# EasyEDA schematic 1-Schematic_TT2.json

## Sheets
1 Sheet_1: TITLE: Sheet_1; REV: 1.0; Date: 2024-10-06; Sheet: 1/1; Drawn By: benjaort2001; Company: Your Company
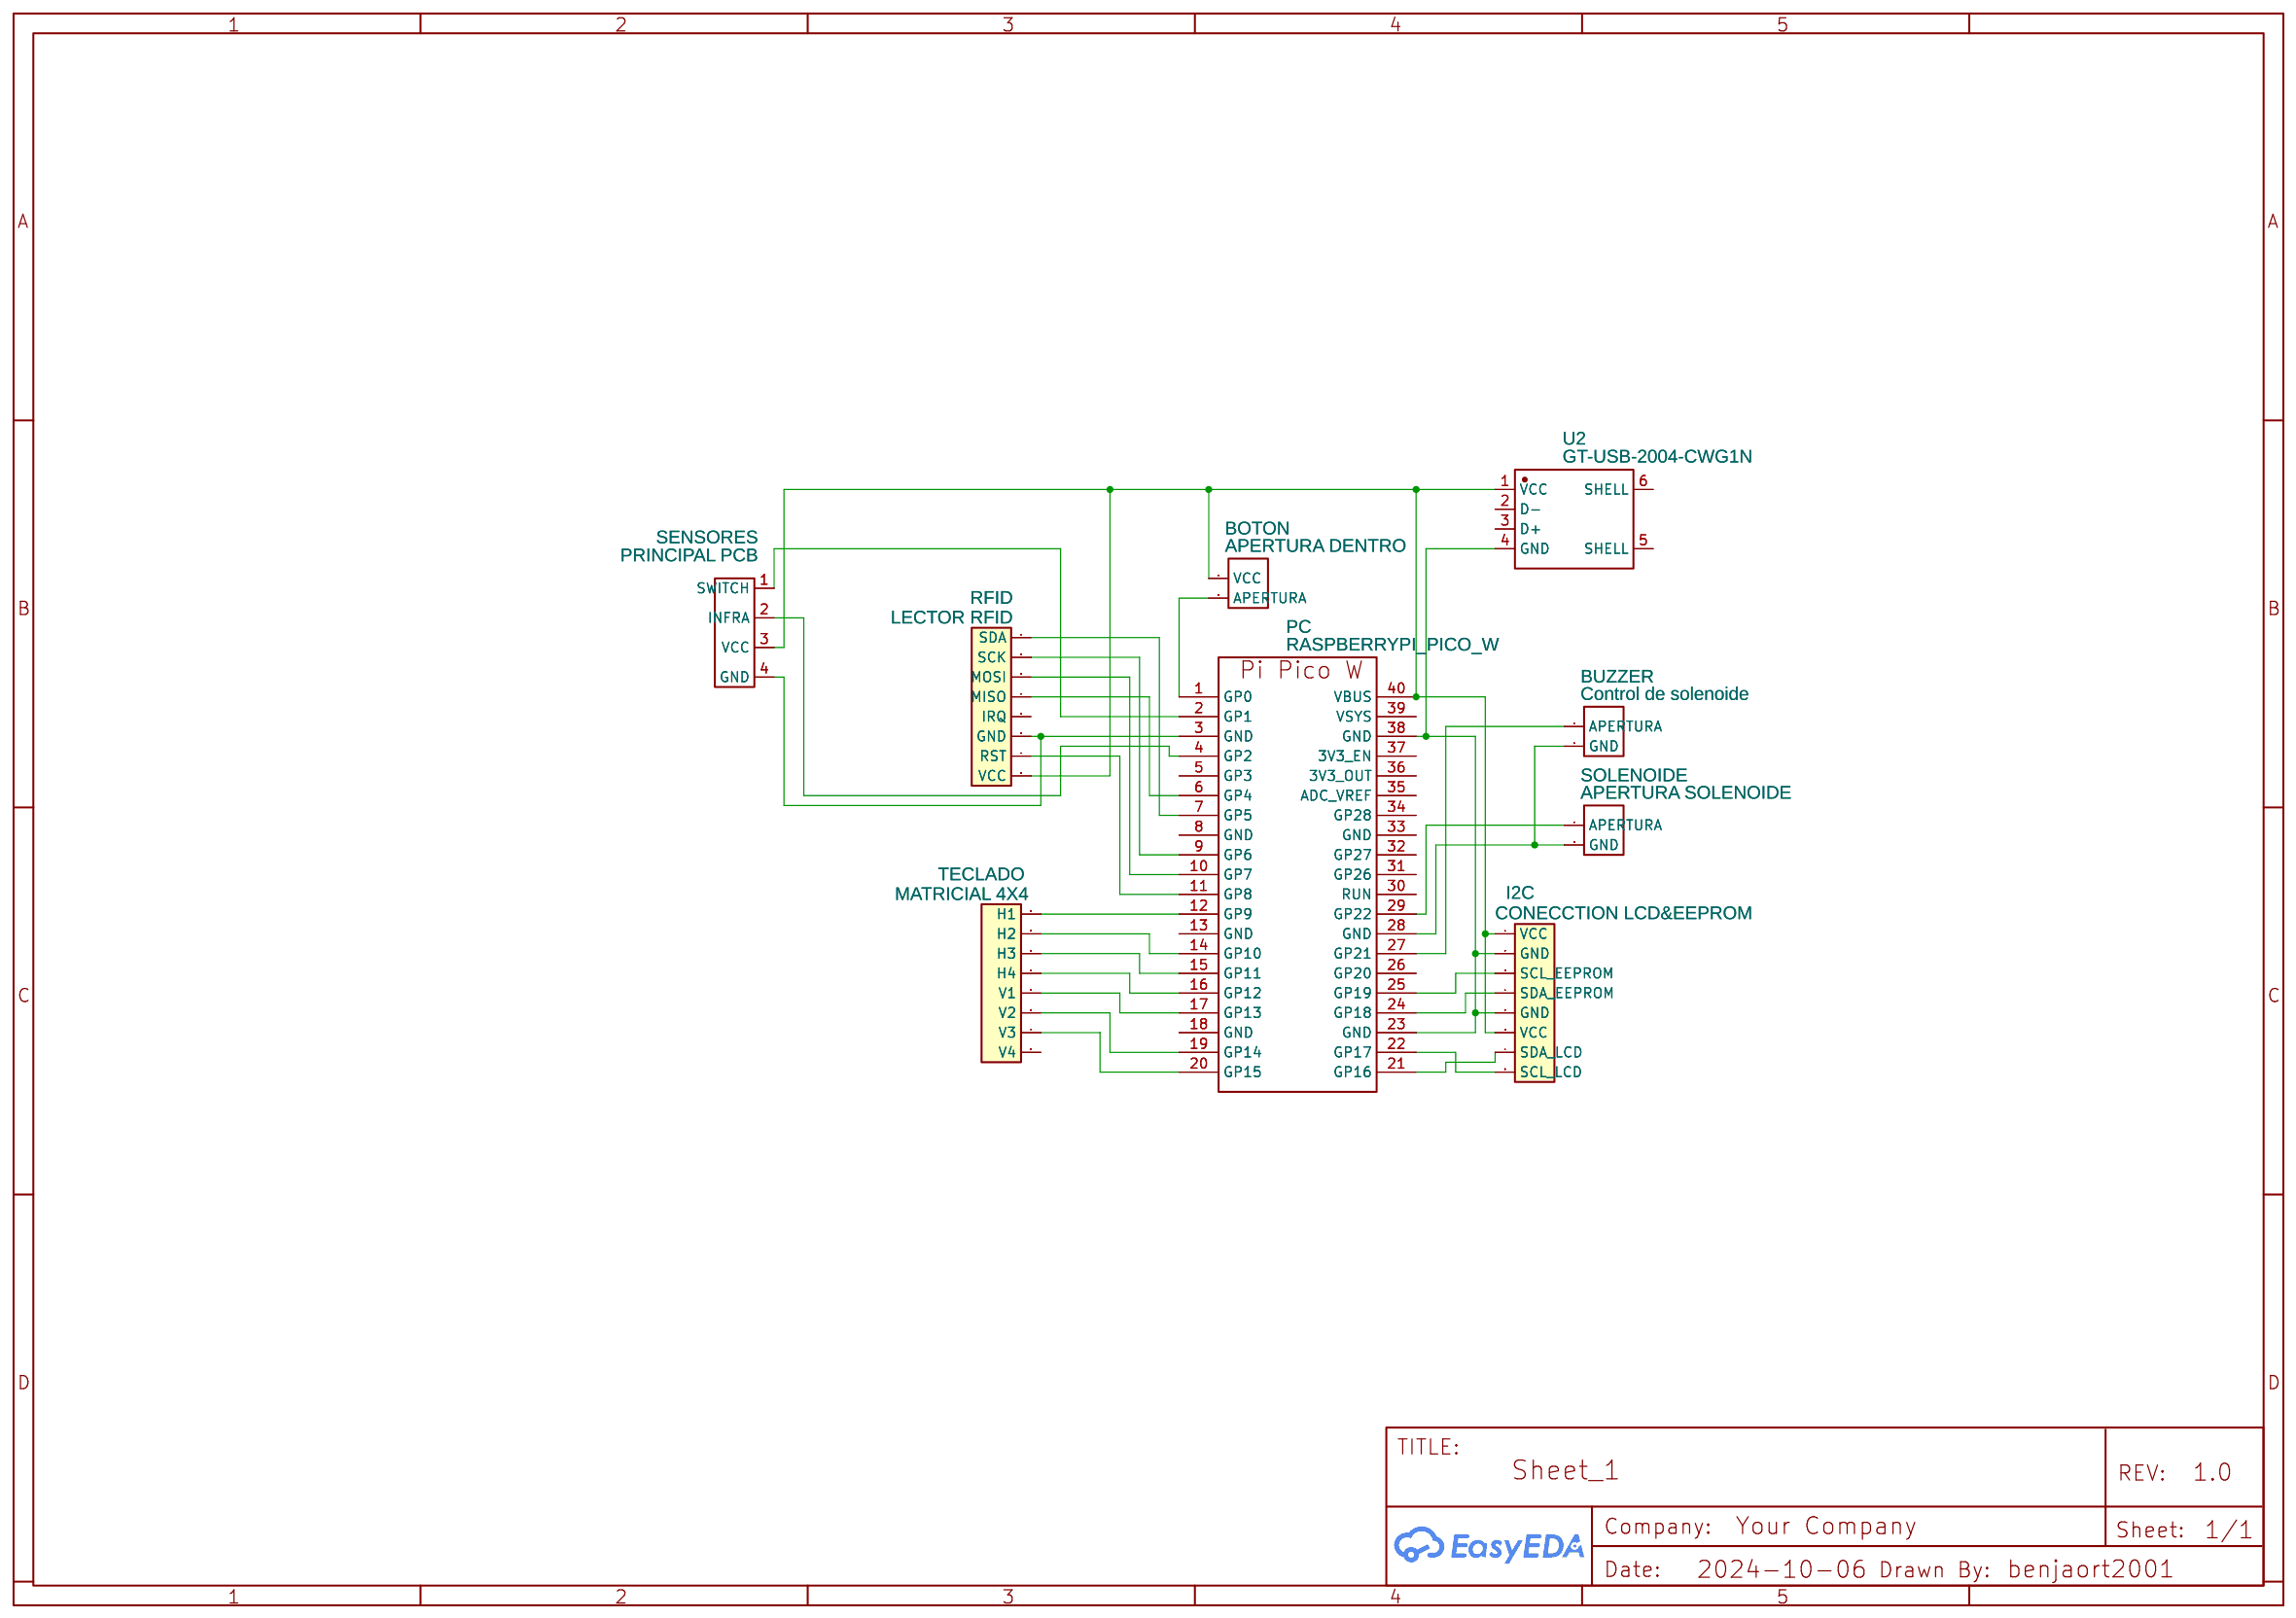
[diagram p0: Sheet_1]
2 Sheet_2: TITLE: Sheet_2; Date: 2024-10-10
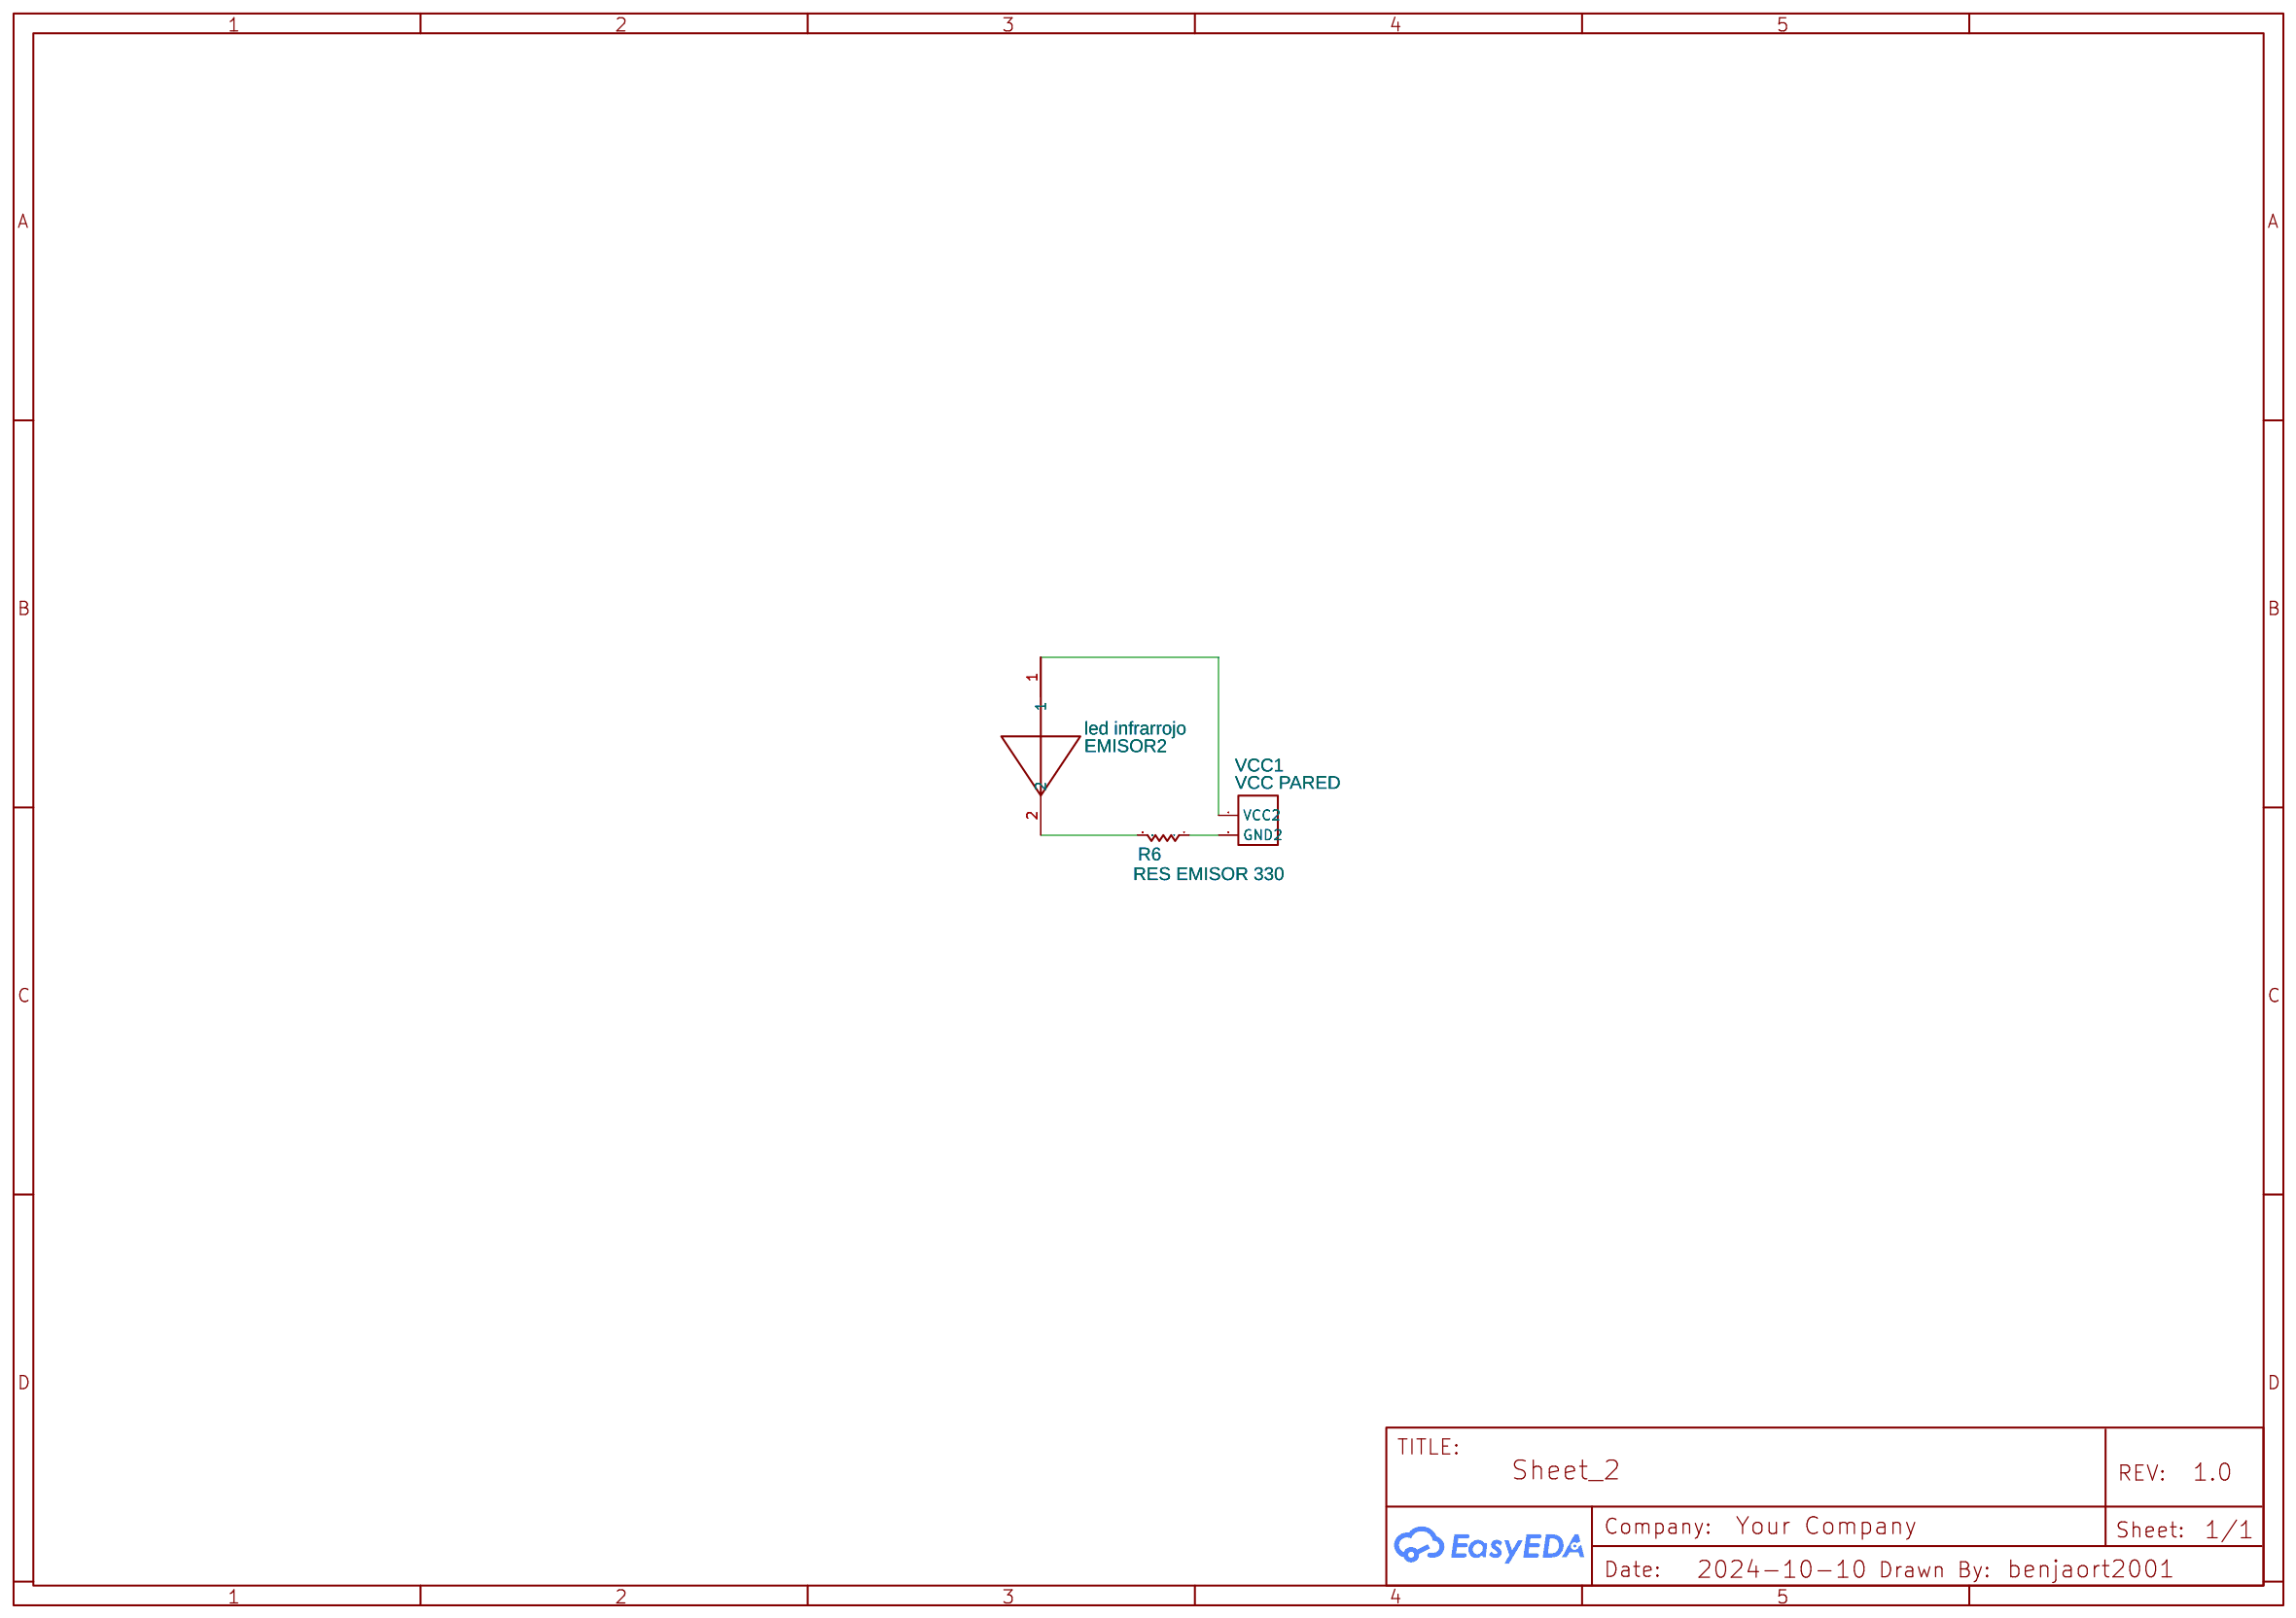
[diagram p1: Sheet_2]
3 Sheet_3: TITLE: Sheet_3; Date: 2024-10-10
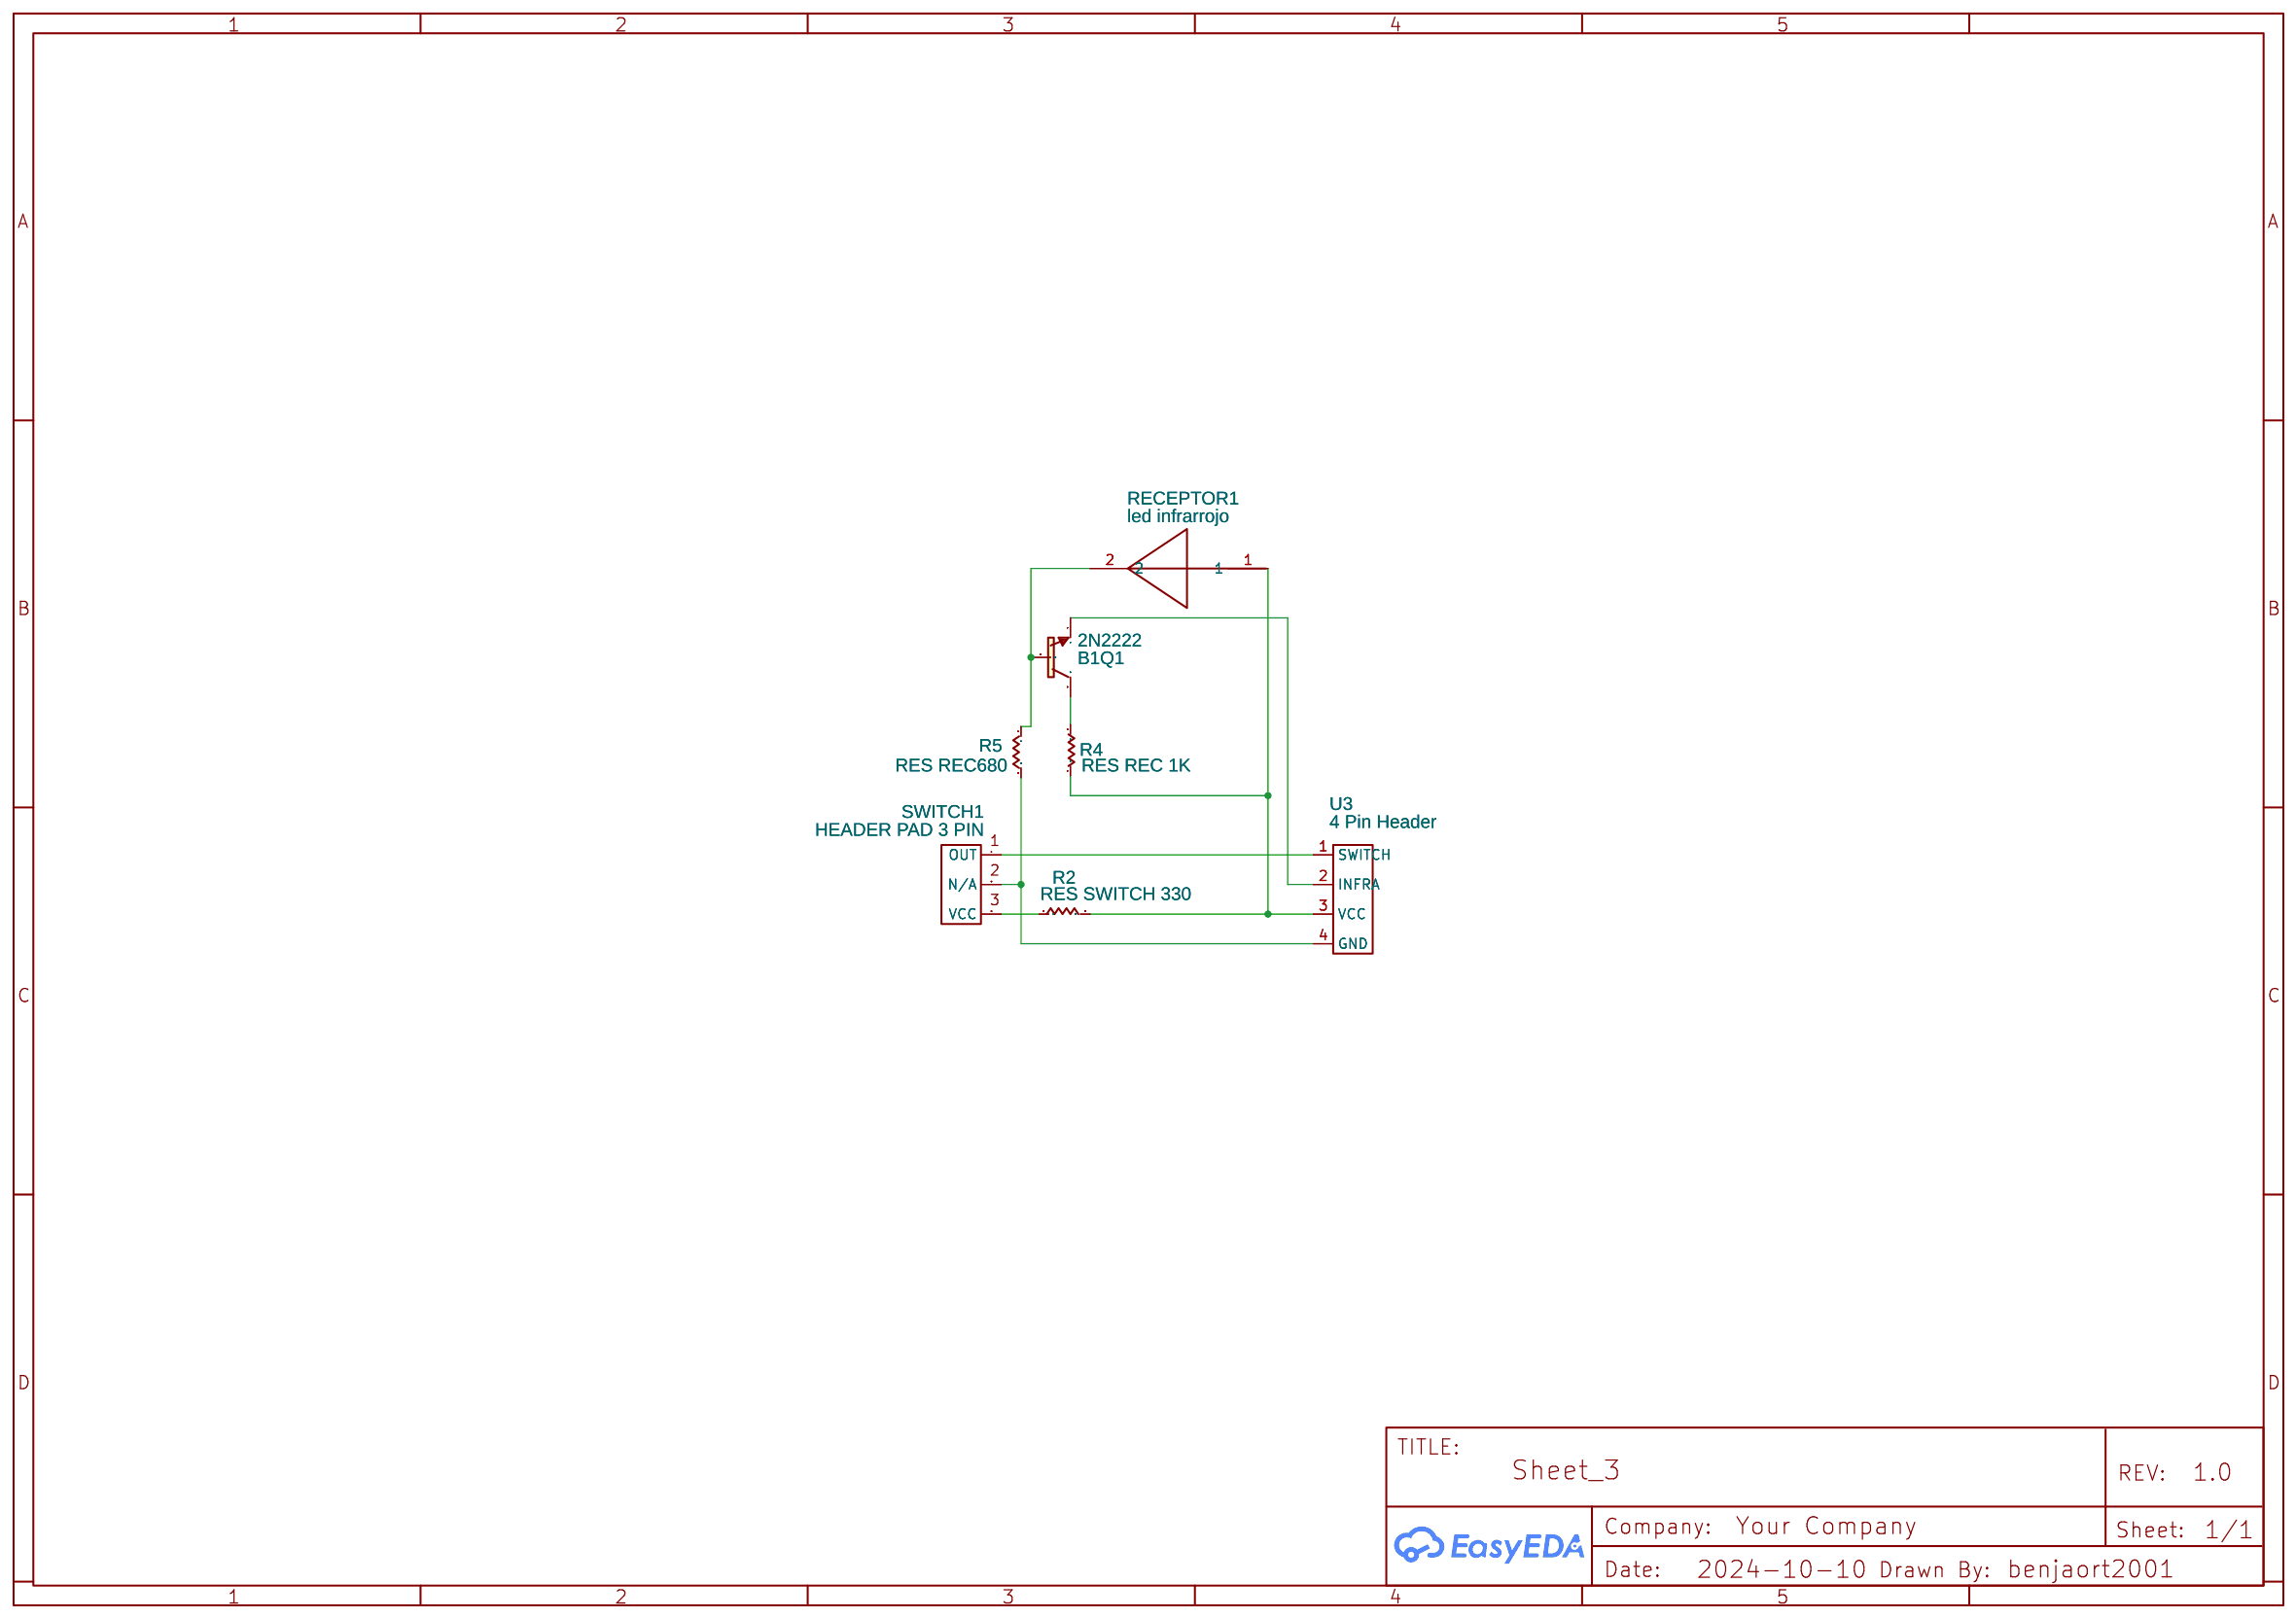
[diagram p2: Sheet_3]

## Parts
sheet Sheet_1
BOTON  APERTURA DENTRO  [CONNECTOR_PINHEADER_2.54MM:PINHEADER_1X11_P_2.54MM]
BUZZER  Control de solenoide  [CONNECTOR_PINHEADER_2.54MM:PINHEADER_1X11_P_2.54MM]
I2C  CONECCTION LCD&EEPROM  [HEADER_08]
PC  RASPBERRYPI_PICO_W  [RASPBERRY_PI_PICO_W]
RFID  LECTOR RFID  [HEADER_08]
SENSORES  PRINCIPAL PCB  [4 PIN HEADER]
SOLENOIDE  APERTURA SOLENOIDE  [CONNECTOR_PINHEADER_2.54MM:PINHEADER_1X11_P_2.54MM]
TECLADO  MATRICIAL 4X4  [HEADER_08]
U2  GT-USB-2004-CWG1N  [USB-A-SMD_GT-USB-2004-CWG1A]
sheet Sheet_2
EMISOR2  led infrarrojo  [LED-DIP-6.1MM]
R6  RES EMISOR 330  [RESISTANCE]
VCC1  VCC PARED  [CONNECTOR_PINHEADER_2.54MM:PINHEADER_1X11_P_2.54MM]
sheet Sheet_3
B1Q1  2N2222  [2N2222A]
R2  RES SWITCH 330  [RESISTANCE]
R4  RES REC 1K  [RESISTANCE]
R5  RES REC680  [RESISTANCE]
RECEPTOR1  led infrarrojo  [LED-DIP-6.1MM]
SWITCH1  HEADER PAD 3 PIN  [CONNECTOR_PINHEADER_2.54MM:PINHEADER_1X3]
U3  4 Pin Header  [4 PIN HEADER]

## Library data of the parts
BOTON BUZZER SOLENOIDE VCC1 = HEADER-FEMALE-2.54_1X2: Supplier: LCSC; Manufacturer: BOOMELE; Manufacturer Part: Female headerHDR1X8-2.54; Supplier Part: C27438; JLCPCB Part Class: Extended Part; Contributor: Jacob KUNNATHOOR
I2C RFID TECLADO = Header 08 copy: Supplier Part: undefined; Contributor: PedroM
PC = RASPBERRY PI PICO W Programmer: Manufacturer: Raspberry Pi Foundation; Manufacturer Part: Pi Pico; Supplier: Element14; Supplier Part: Pi Pico W; link: https://datasheets.raspberrypi.com/picow/pico-w-datasheet.pdf; Contributor: moulanier
SENSORES U3 = 4 Pin Header: Contributor: hreehoorn
U2 = GT-USB-2004-CWG1N: Contributor: lcsc; Supplier: LCSC; Supplier Part: C5117889; Manufacturer: G-Switch(品赞); JLCPCB Part Class: Extended Part
EMISOR2 = led infrarrojo: Contributor: arex314
R2 R4-R6 = Resis: Manufacturer Part: resistence; Contributor: syadav
B1Q1 = 2N2222A facile for souder: Contributor: HURARD; Supplier: LCSC
RECEPTOR1 = led infrarrojo: Contributor: arex314; Package Display: No
SWITCH1 = HEADER PAD 3 PIN: Supplier: LCSC; Manufacturer: BOOMELE; Manufacturer Part: Female headerHDR1X8-2.54; Supplier Part: C27438; JLCPCB Part Class: Extended Part; Contributor: vincentboisselier

## Nets
Net-(B1Q1-1): B1Q1.1(E) U3.2(INFRA)
Net-(B1Q1-2): B1Q1.2(B) R5.1 RECEPTOR1.2
Net-(B1Q1-3): B1Q1.3(C) R4.2
Net-(BOTON-1): BOTON.1(VCC) I2C.1(VCC) I2C.6(VCC) PC.40(VBUS) RFID.8(VCC) SENSORES.3(VCC) U2.1(VCC)
Net-(BOTON-2): BOTON.2(APERTURA) PC.1(GP0)
Net-(BUZZER-1): BUZZER.1(APERTURA) PC.27(GP21)
Net-(BUZZER-2): BUZZER.2(GND) PC.28(GND) SOLENOIDE.2(GND)
Net-(EMISOR2-1): EMISOR2.1 VCC1.1(VCC2)
Net-(EMISOR2-2): EMISOR2.2 R6.2
Net-(I2C-2): I2C.2(GND) I2C.5(GND) PC.23(GND) PC.38(GND) U2.4(GND)
Net-(I2C-3): I2C.3(SCL_EEPROM) PC.25(GP19)
Net-(I2C-4): I2C.4(SDA_EEPROM) PC.24(GP18)
Net-(I2C-7): I2C.7(SDA_LCD) PC.21(GP16)
Net-(I2C-8): I2C.8(SCL_LCD) PC.22(GP17)
Net-(PC-2): PC.2(GP1) SENSORES.1(SWITCH)
Net-(PC-3): PC.3(GND) RFID.6(GND) SENSORES.4(GND)
Net-(PC-4): PC.4(GP2) SENSORES.2(INFRA)
Net-(PC-6): PC.6(GP4) RFID.4(MISO)
Net-(PC-7): PC.7(GP5) RFID.1(SDA)
Net-(PC-9): PC.9(GP6) RFID.2(SCK)
Net-(PC-10): PC.10(GP7) RFID.3(MOSI)
Net-(PC-11): PC.11(GP8) RFID.7(RST)
Net-(PC-12): PC.12(GP9) TECLADO.1(H1)
Net-(PC-14): PC.14(GP10) TECLADO.2(H2)
Net-(PC-15): PC.15(GP11) TECLADO.3(H3)
Net-(PC-16): PC.16(GP12) TECLADO.4(H4)
Net-(PC-17): PC.17(GP13) TECLADO.5(V1)
Net-(PC-19): PC.19(GP14) TECLADO.6(V2)
Net-(PC-20): PC.20(GP15) TECLADO.7(V3)
Net-(PC-29): PC.29(GP22) SOLENOIDE.1(APERTURA)
Net-(R2-1): R2.1 R4.1 RECEPTOR1.1 U3.3(VCC)
Net-(R2-2): R2.2 SWITCH1.3(VCC)
Net-(R5-2): R5.2 SWITCH1.2(N/A) U3.4(GND)
Net-(R6-1): R6.1 VCC1.2(GND2)
Net-(SWITCH1-1): SWITCH1.1(OUT) U3.1(SWITCH)

Not connected (* = marked no-connect by the designer): PC 5(GP3) 8(GND) 13(GND) 18(GND) 26(GP20) 30(RUN) 31(GP26) 32(GP27) 33(GND) 34(GP28) 35(ADC_VREF) 36(3V3_OUT) 37(3V3_EN) 39(VSYS); RFID 5(IRQ); TECLADO 8(V4); U2 2(D-) 3(D+) 5(SHELL) 6(SHELL)
